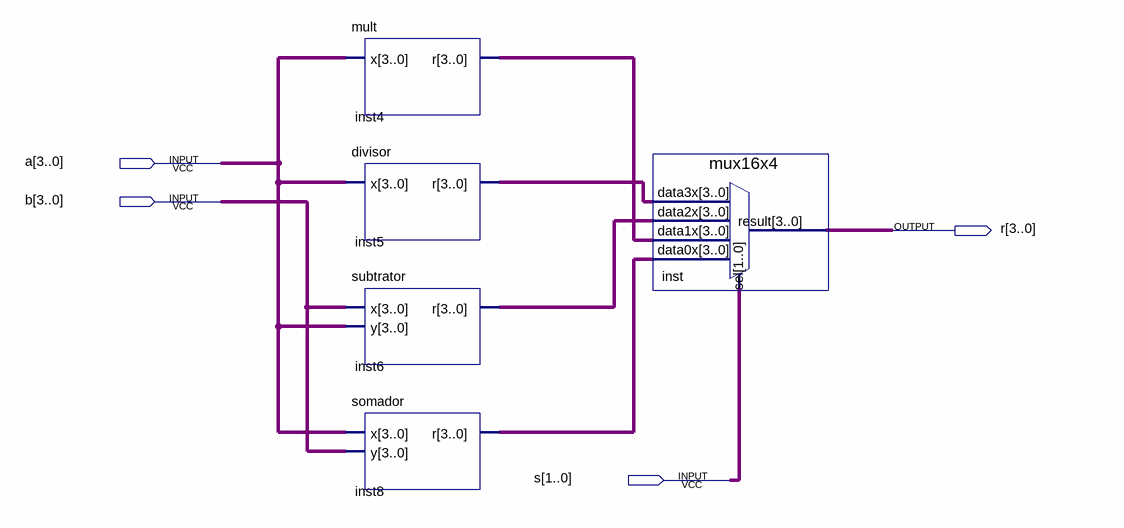
[diagram p0: schematic sheet]
// Quartus schematic ula.bdf as structural Verilog: 5 symbols, 4 pins
module ula (
  input  [3:0] a,
  input  [3:0] b,
  input  [1:0] s,
  output [3:0] r
);

  wire [3:0] inst4_r, inst5_r, inst6_r, inst8_r;

  mult inst4 (.x(a), .r(inst4_r));
  divisor inst5 (.x(a), .r(inst5_r));
  subtrator inst6 (.x(b), .y(a), .r(inst6_r));
  somador inst8 (.x(a), .y(b), .r(inst8_r));
  mux16x4 inst (.data3x(inst5_r), .data2x(inst6_r), .data1x(inst4_r), .data0x(inst8_r), .sel(s), .result(r));
endmodule
